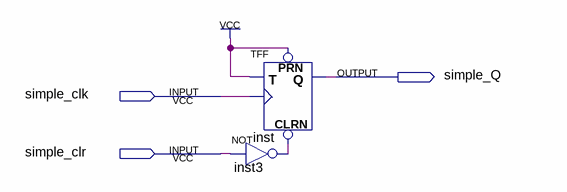
[diagram p0: schematic sheet]
// Quartus schematic simpleT.bdf as structural Verilog: 2 symbols, 3 pins
module simpleT (
  input  simple_clk,
  input  simple_clr,
  output simple_Q
);

  wire inst3_out;

  TFF inst (.PRN(1'b1), .CLRN(inst3_out), .T(1'b1), .CLK(simple_clk), .Q(simple_Q));
  not inst3 (inst3_out, simple_clr);
endmodule
